# EAGLE design skatemate_proto (EAGLE 7.6.0)

## Sheet 1 of 3
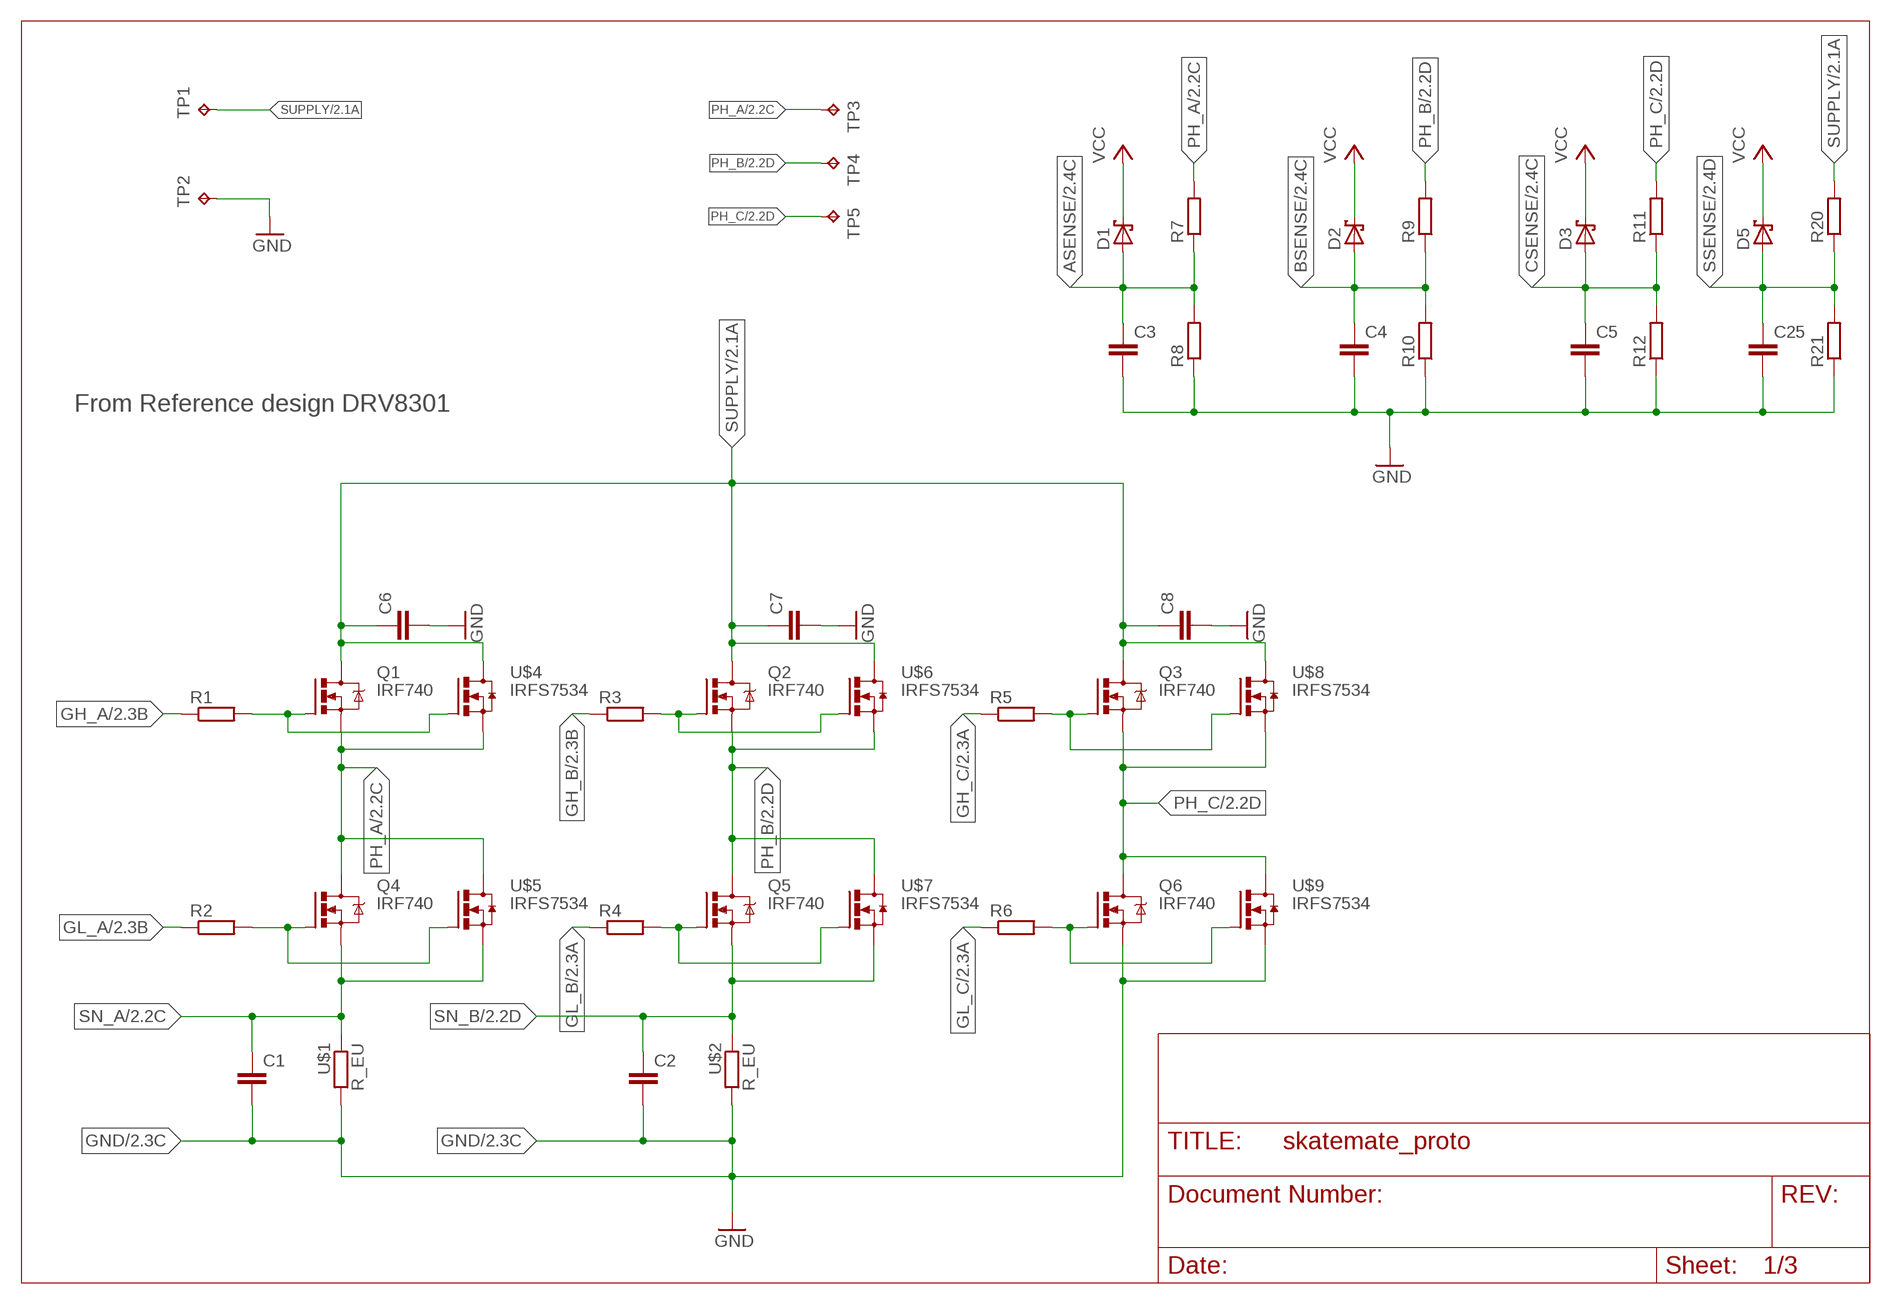
[diagram p0: schematic, sheet 1]

### Parts
C1  C-EUC0805  [C0805]
C2  C-EUC0805  [C0805]
C3  C-EUC0805  [C0805]
C4  C-EUC0805  [C0805]
C5  C-EUC0805  [C0805]
C6  C-EUC1206  [C1206]
C7  C-EUC1206  [C1206]
C8  C-EUC1206  [C1206]
C25  C-EUC0805  [C0805]
D1  SCHOTTKY-DIODESOD80C  [SOD80C]
D2  SCHOTTKY-DIODESOD80C  [SOD80C]
D3  SCHOTTKY-DIODESOD80C  [SOD80C]
D5  SCHOTTKY-DIODESOD80C  [SOD80C]
Q1  IRF740  [TO220BV]
Q2  IRF740  [TO220BV]
Q3  IRF740  [TO220BV]
Q4  IRF740  [TO220BV]
Q5  IRF740  [TO220BV]
Q6  IRF740  [TO220BV]
R1  R-EU_R0805  [R0805]
R2  R-EU_R0805  [R0805]
R3  R-EU_R0805  [R0805]
R4  R-EU_R0805  [R0805]
R5  R-EU_R0805  [R0805]
R6  R-EU_R0805  [R0805]
R7  R-EU_R0805  [R0805]
R8  R-EU_R0805  [R0805]
R9  R-EU_R0805  [R0805]
R10  R-EU_R0805  [R0805]
R11  R-EU_R0805  [R0805]
R12  R-EU_R0805  [R0805]
R20  R-EU_R0805  [R0805]
R21  R-EU_R0805  [R0805]
TP1  TPSMD_M_1006  [SMD_M_1006]
TP2  TPSMD_M_1006  [SMD_M_1006]
TP3  TPSMD_M_1006  [SMD_M_1006]
TP4  TPSMD_M_1006  [SMD_M_1006]
TP5  TPSMD_M_1006  [SMD_M_1006]
U$1  R_EU  [R2512]
U$2  R_EU  [R2512]
U$4  IRFS7534  [D2PAK-7]
U$5  IRFS7534  [D2PAK-7]
U$6  IRFS7534  [D2PAK-7]
U$7  IRFS7534  [D2PAK-7]
U$8  IRFS7534  [D2PAK-7]
U$9  IRFS7534  [D2PAK-7]

### Nets
ASENSE: C3.1 D1.A R7.1 R8.2 ; also sheet 2,3
BSENSE: C4.1 D2.A R9.1 R10.2 ; also sheet 2,3
CSENSE: C5.1 D3.A R11.1 R12.2 ; also sheet 2,3
GH_A: R1.1 ; also sheet 2
GH_B: R3.1 ; also sheet 2
GH_C: R5.1 ; also sheet 2
GL_A: R2.1 ; also sheet 2
GL_B: R4.1 ; also sheet 2
GL_C: R6.1 ; also sheet 2
GND: C1.2 C2.2 C3.2 C4.2 C5.2 C6.2 C7.2 C8.2 C25.2 Q6.S R8.1 R10.1 R12.1 R21.1 TP2.P$1(TP) U$1.2 U$2.2 U$9.S1(S) U$9.S2(S) U$9.S3(S) U$9.S4(S) U$9.S5(S) ; also sheet 2,3
N$7: Q1.G R1.2 U$4.G
N$8: Q4.G R2.2 U$5.G
N$9: Q5.G R4.2 U$7.G
N$10: Q2.G R3.2 U$6.G
N$11: Q3.G R5.2 U$8.G
N$12: Q6.G R6.2 U$9.G
PH_A: Q1.S Q4.D R7.2 TP3.P$1(TP) U$4.S1(S) U$4.S2(S) U$4.S3(S) U$4.S4(S) U$4.S5(S) U$5.D ; also sheet 2
PH_B: Q2.S Q5.D R9.2 TP4.P$1(TP) U$6.S1(S) U$6.S2(S) U$6.S3(S) U$6.S4(S) U$6.S5(S) U$7.D ; also sheet 2
PH_C: Q3.S Q6.D R11.2 TP5.P$1(TP) U$8.S1(S) U$8.S2(S) U$8.S3(S) U$8.S4(S) U$8.S5(S) U$9.D ; also sheet 2
SN_A: C1.1 Q4.S U$1.1 U$5.S1(S) U$5.S2(S) U$5.S3(S) U$5.S4(S) U$5.S5(S) ; also sheet 2
SN_B: C2.1 Q5.S U$2.1 U$7.S1(S) U$7.S2(S) U$7.S3(S) U$7.S4(S) U$7.S5(S) ; also sheet 2
SSENSE: C25.1 D5.A R20.1 R21.2 ; also sheet 2,3
SUPPLY: C6.1 C7.1 C8.1 Q1.D Q2.D Q3.D R20.2 TP1.P$1(TP) U$4.D U$6.D U$8.D ; also sheet 2
VCC: D1.C D2.C D3.C D5.C ; also sheet 2,3

### Notes on the sheet
- From Reference design DRV8301

## Sheet 2 of 3
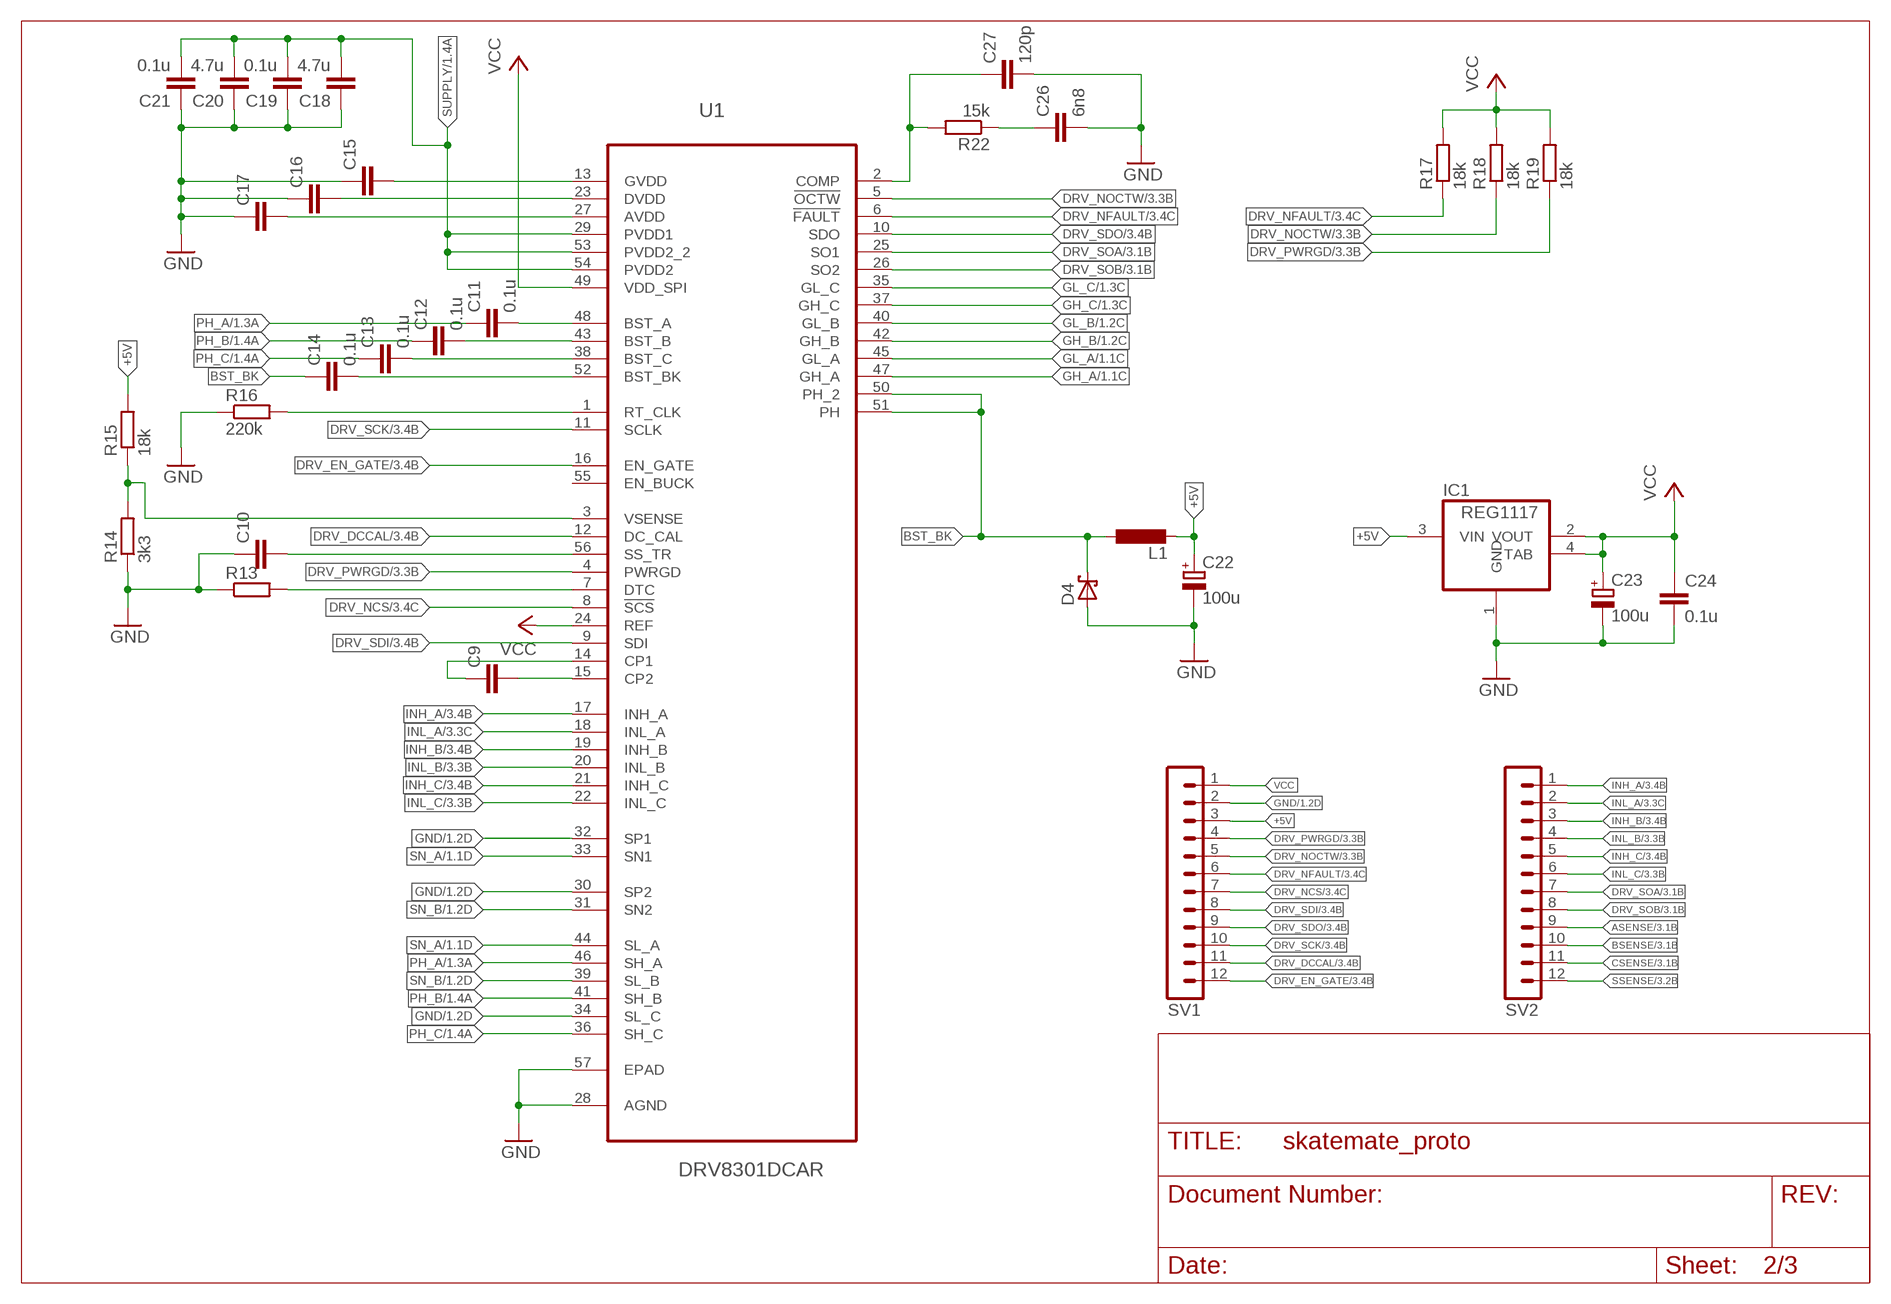
[diagram p1: schematic, sheet 2]

### Parts
C9  C-EUC0805  [C0805]
C10  C-EUC0805  [C0805]
C11  0.1u  C-EUC0805  [C0805]
C12  0.1u  C-EUC0805  [C0805]
C13  0.1u  C-EUC0805  [C0805]
C14  0.1u  C-EUC0805  [C0805]
C15  C-EUC0805  [C0805]
C16  C-EUC0805  [C0805]
C17  C-EUC0805  [C0805]
C18  4.7u  C-EUC0805  [C0805]
C19  0.1u  C-EUC0805  [C0805]
C20  4.7u  C-EUC0805  [C0805]
C21  0.1u  C-EUC0805  [C0805]
C22  100u  CPOL-EUB/3528-21W  [B/3528-21W]
C23  100u  CPOL-EUB/3528-21W  [B/3528-21W]
C24  0.1u  C-EUC0805  [C0805]
C26  6n8  C-EUC0805  [C0805]
C27  120p  C-EUC0805  [C0805]
D4  SCHOTTKY-DIODEDO-214AA  [DO-214AA]
IC1  REG1117  [SOT223]
L1  L-EUSDR0805  [SDR0805]
R13  R-EU_R0805  [R0805]
R14  3k3  R-EU_R0805  [R0805]
R15  18k  R-EU_R0805  [R0805]
R16  220k  R-EU_R0805  [R0805]
R17  18k  R-EU_R0805  [R0805]
R18  18k  R-EU_R0805  [R0805]
R19  18k  R-EU_R0805  [R0805]
R22  15k  R-EU_R0805  [R0805]
SV1  MA12-1  [MA12-1]
SV2  MA12-1  [MA12-1]
U1  DRV8301DCAR  [SOP50P810X120-57N]

### Nets
+5V: C22.+ IC1.3(VIN) L1.2 R15.2 SV1.3
ASENSE: SV2.9 ; also sheet 1,3
BSENSE: SV2.10 ; also sheet 1,3
BST_BK: C14.1 D4.C L1.1 U1.50(PH_2) U1.51(PH)
CSENSE: SV2.11 ; also sheet 1,3
DRV_DCCAL: SV1.11 U1.12(DC_CAL) ; also sheet 3
DRV_EN_GATE: SV1.12 U1.16(EN_GATE) ; also sheet 3
DRV_NCS: SV1.7 U1.8(!SCS) ; also sheet 3
DRV_NFAULT: R17.1 SV1.6 U1.6(!FAULT) ; also sheet 3
DRV_NOCTW: R18.1 SV1.5 U1.5(!OCTW) ; also sheet 3
DRV_PWRGD: R19.1 SV1.4 U1.4(PWRGD) ; also sheet 3
DRV_SCK: SV1.10 U1.11(SCLK) ; also sheet 3
DRV_SDI: SV1.8 U1.9(SDI) ; also sheet 3
DRV_SDO: SV1.9 U1.10(SDO) ; also sheet 3
DRV_SOA: SV2.7 U1.25(SO1) ; also sheet 3
DRV_SOB: SV2.8 U1.26(SO2) ; also sheet 3
GH_A: U1.47(GH_A) ; also sheet 1
GH_B: U1.42(GH_B) ; also sheet 1
GH_C: U1.37(GH_C) ; also sheet 1
GL_A: U1.45(GL_A) ; also sheet 1
GL_B: U1.40(GL_B) ; also sheet 1
GL_C: U1.35(GL_C) ; also sheet 1
GND: C10.1 C15.1 C16.1 C17.1 C18.1 C19.1 C20.1 C21.1 C22.- C23.- C24.2 C26.2 C27.2 D4.A IC1.1(GND) R13.1 R14.1 R16.1 SV1.2 U1.28(AGND) U1.30(SP2) U1.32(SP1) U1.34(SL_C) U1.57(EPAD) ; also sheet 1,3
INH_A: SV2.1 U1.17(INH_A) ; also sheet 3
INH_B: SV2.3 U1.19(INH_B) ; also sheet 3
INH_C: SV2.5 U1.21(INH_C) ; also sheet 3
INL_A: SV2.2 U1.18(INL_A) ; also sheet 3
INL_B: SV2.4 U1.20(INL_B) ; also sheet 3
INL_C: SV2.6 U1.22(INL_C) ; also sheet 3
N$1: C9.2 U1.15(CP2)
N$2: C9.1 U1.14(CP1)
N$3: R13.2 U1.7(DTC)
N$4: R14.2 R15.1 U1.3(VSENSE)
N$5: C10.2 U1.56(SS_TR)
N$6: R16.2 U1.1(RT_CLK)
N$13: C11.2 U1.48(BST_A)
N$14: C12.2 U1.43(BST_B)
N$15: C13.2 U1.38(BST_C)
N$16: C14.2 U1.52(BST_BK)
N$17: C15.2 U1.13(GVDD)
N$18: C16.2 U1.23(DVDD)
N$19: C17.2 U1.27(AVDD)
N$20: C27.1 R22.2 U1.2(COMP)
N$21: C26.1 R22.1
PH_A: C11.1 U1.46(SH_A) ; also sheet 1
PH_B: C12.1 U1.41(SH_B) ; also sheet 1
PH_C: C13.1 U1.36(SH_C) ; also sheet 1
SN_A: U1.33(SN1) U1.44(SL_A) ; also sheet 1
SN_B: U1.31(SN2) U1.39(SL_B) ; also sheet 1
SSENSE: SV2.12 ; also sheet 1,3
SUPPLY: C18.2 C19.2 C20.2 C21.2 U1.29(PVDD1) U1.53(PVDD2_2) U1.54(PVDD2) ; also sheet 1
VCC: C23.+ C24.1 IC1.2(VOUT) IC1.4(TAB) R17.2 R18.2 R19.2 SV1.1 U1.24(REF) U1.49(VDD_SPI) ; also sheet 1,3
Unconnected: U1.55(EN_BUCK)

## Sheet 3 of 3
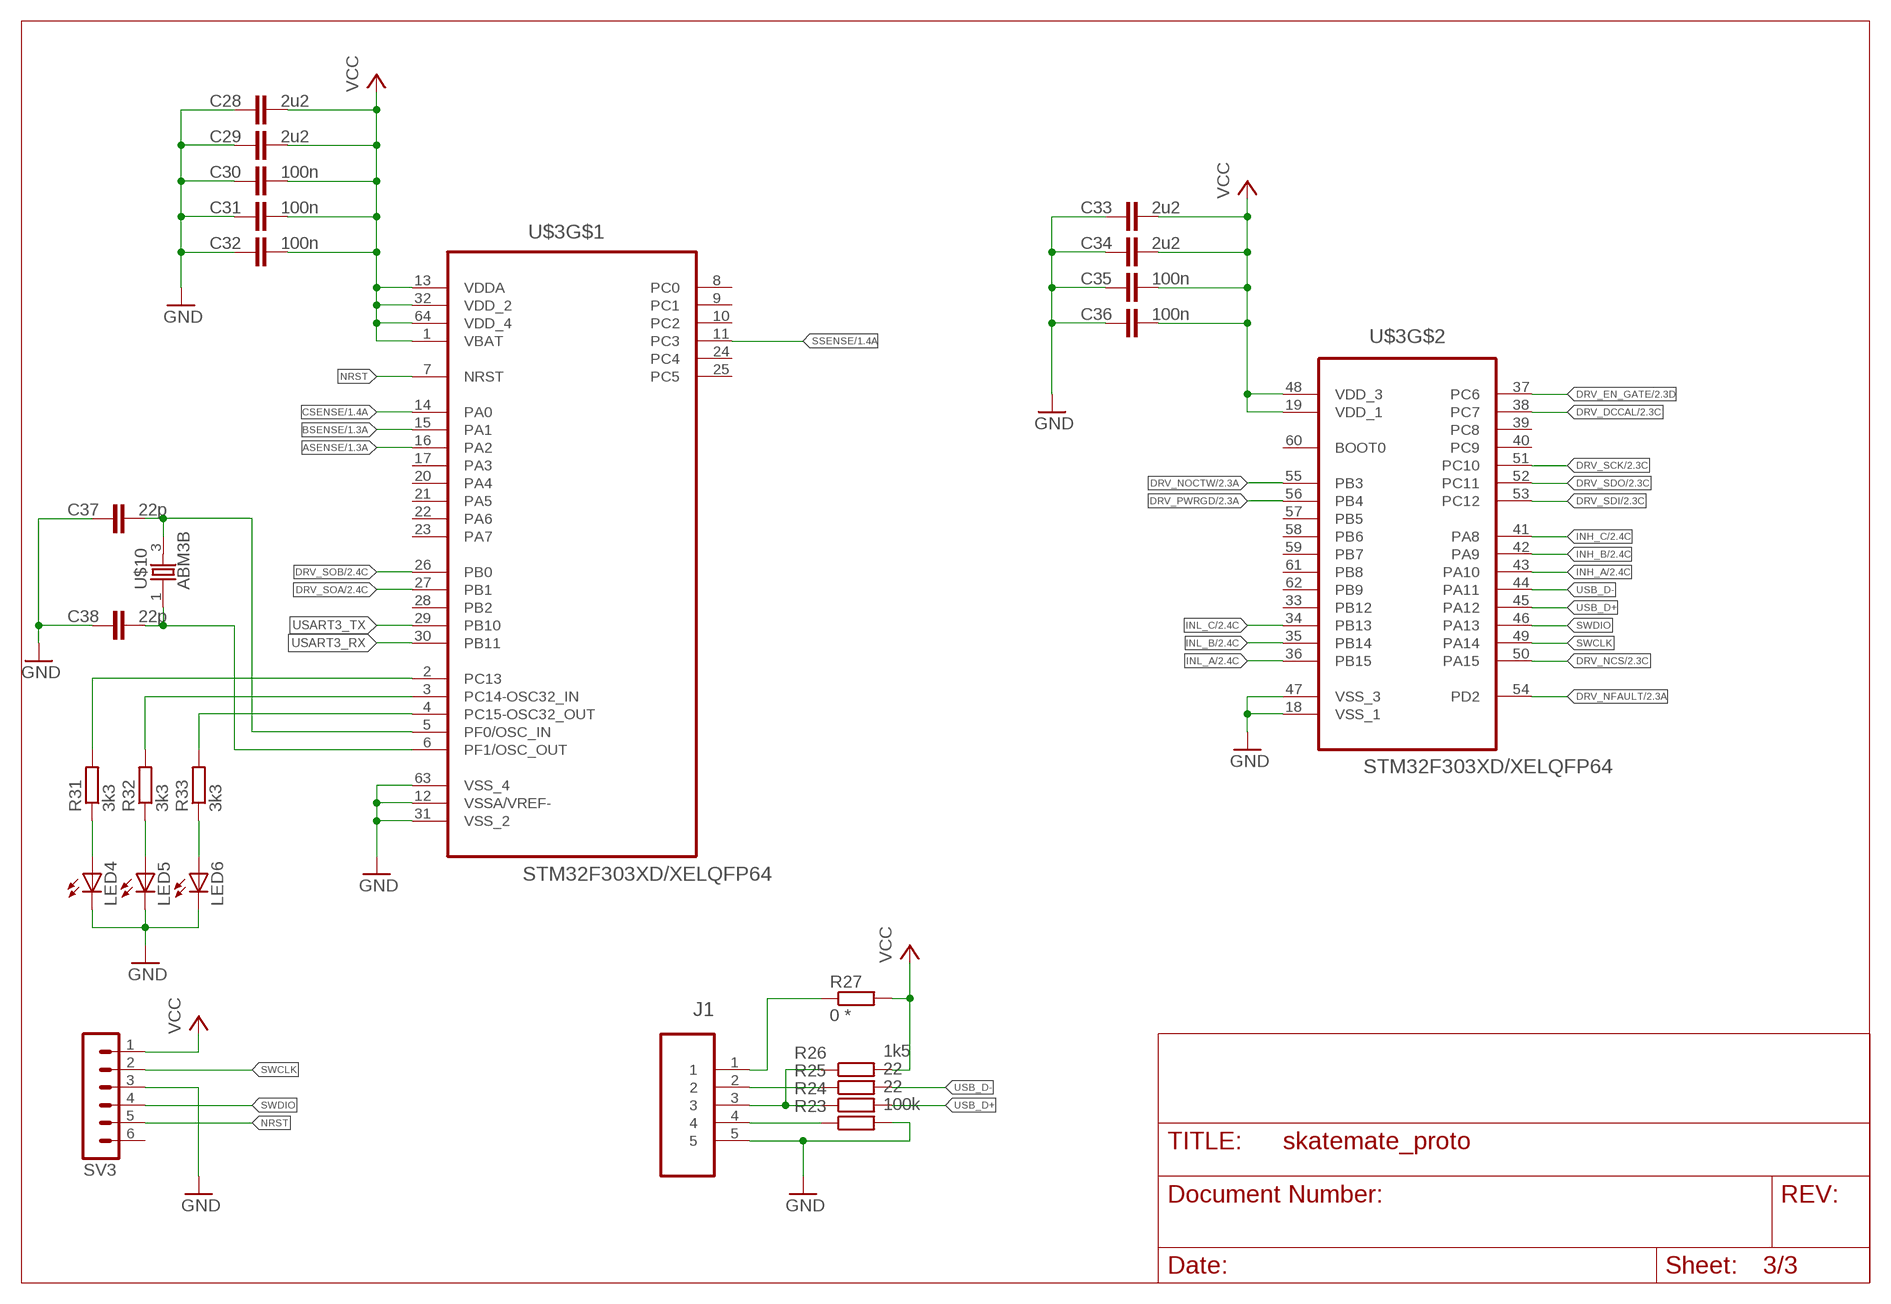
[diagram p2: schematic, sheet 3]

### Parts
C28  2u2  C-EUC0805  [C0805]
C29  2u2  C-EUC0805  [C0805]
C30  100n  C-EUC0805  [C0805]
C31  100n  C-EUC0805  [C0805]
C32  100n  C-EUC0805  [C0805]
C33  2u2  C-EUC0805  [C0805]
C34  2u2  C-EUC0805  [C0805]
C35  100n  C-EUC0805  [C0805]
C36  100n  C-EUC0805  [C0805]
C37  22p  C-EUC0805  [C0805]
C38  22p  C-EUC0805  [C0805]
J1  47346-0001  [MOLEX_47346-0001]
LED4  LEDCHIP-LED0805  [CHIP-LED0805]
LED5  LEDCHIP-LED0805  [CHIP-LED0805]
LED6  LEDCHIP-LED0805  [CHIP-LED0805]
R23  100k  R-EU_R0805  [R0805]
R24  22  R-EU_R0805  [R0805]
R25  22  R-EU_R0805  [R0805]
R26  1k5  R-EU_R0805  [R0805]
R27  0 *  R-EU_R0805  [R0805]
R31  3k3  R-EU_R0805  [R0805]
R32  3k3  R-EU_R0805  [R0805]
R33  3k3  R-EU_R0805  [R0805]
SV3  MA06-1  [MA06-1]
U$3  STM32F303XD/XELQFP64  [LQFP64]
U$10  ABM3B  [IQG5032B]

### Nets
ASENSE: U$3.16(PA2) ; also sheet 1,2
BSENSE: U$3.15(PA1) ; also sheet 1,2
CSENSE: U$3.14(PA0) ; also sheet 1,2
DRV_DCCAL: U$3.38(PC7) ; also sheet 2
DRV_EN_GATE: U$3.37(PC6) ; also sheet 2
DRV_NCS: U$3.50(PA15) ; also sheet 2
DRV_NFAULT: U$3.54(PD2) ; also sheet 2
DRV_NOCTW: U$3.55(PB3) ; also sheet 2
DRV_PWRGD: U$3.56(PB4) ; also sheet 2
DRV_SCK: U$3.51(PC10) ; also sheet 2
DRV_SDI: U$3.53(PC12) ; also sheet 2
DRV_SDO: U$3.52(PC11) ; also sheet 2
DRV_SOA: U$3.27(PB1) ; also sheet 2
DRV_SOB: U$3.26(PB0) ; also sheet 2
GND: C28.1 C29.1 C30.1 C31.1 C32.1 C33.1 C34.1 C35.1 C36.1 C37.1 C38.1 J1.5 LED4.C LED5.C LED6.C R23.2 SV3.3 U$3.12(VSSA/VREF-) U$3.18(VSS_1) U$3.31(VSS_2) U$3.47(VSS_3) U$3.63(VSS_4) ; also sheet 1,2
INH_A: U$3.43(PA10) ; also sheet 2
INH_B: U$3.42(PA9) ; also sheet 2
INH_C: U$3.41(PA8) ; also sheet 2
INL_A: U$3.36(PB15) ; also sheet 2
INL_B: U$3.35(PB14) ; also sheet 2
INL_C: U$3.34(PB13) ; also sheet 2
N$22: J1.4 R23.1
N$23: J1.3 R24.1 R26.1
N$24: J1.2 R25.1
N$25: J1.1 R27.1
N$28: R33.2 U$3.4(PC15-OSC32_OUT)
N$29: R32.2 U$3.3(PC14-OSC32_IN)
N$30: R31.2 U$3.2(PC13)
N$31: LED4.A R31.1
N$32: LED5.A R32.1
N$33: LED6.A R33.1
N$35: C38.2 U$3.6(PF1/OSC_OUT) U$10.1
N$36: C37.2 U$3.5(PF0/OSC_IN) U$10.3
NRST: SV3.5 U$3.7(NRST)
SSENSE: U$3.11(PC3) ; also sheet 1,2
SWCLK: SV3.2 U$3.49(PA14)
SWDIO: SV3.4 U$3.46(PA13)
USART3_RX: U$3.30(PB11)
USART3_TX: U$3.29(PB10)
USB_D+: R24.2 U$3.45(PA12)
USB_D-: R25.2 U$3.44(PA11)
VCC: C28.2 C29.2 C30.2 C31.2 C32.2 C33.2 C34.2 C35.2 C36.2 R26.2 R27.2 SV3.1 U$3.1(VBAT) U$3.13(VDDA) U$3.19(VDD_1) U$3.32(VDD_2) U$3.48(VDD_3) U$3.64(VDD_4) ; also sheet 1,2
Unconnected: SV3.6 U$3.8(PC0) U$3.9(PC1) U$3.10(PC2) U$3.17(PA3) U$3.20(PA4) U$3.21(PA5) U$3.22(PA6) U$3.23(PA7) U$3.24(PC4) U$3.25(PC5) U$3.28(PB2) U$3.33(PB12) U$3.39(PC8) U$3.40(PC9) U$3.57(PB5) U$3.58(PB6) U$3.59(PB7) U$3.60(BOOT0) U$3.61(PB8) U$3.62(PB9)

## Library data of the parts
C1-C21 C24-C38 = skatemate:C-EU: CAPACITOR, European symbol
C22 C23 = skatemate:CPOL-EU: POLARIZED CAPACITOR, European symbol
D1-D5 = skatemate:SCHOTTKY-DIODE: Schottky Diode
IC1 = skatemate:REG1117: 800mA and 1A Low Dropout (LDO) Positive Regulator 1.8V, 2.5V, 2.85V, 3.3V, 5V, and Adj; MPN: REG1117; OC_FARNELL: 1097566; OC_NEWARK: 14P6981
J1 = skatemate:47346-0001: CONN RCPT 5POS MICRO USB R/A SMD; MPN: 47346-0001; OC_FARNELL: 1568026; OC_NEWARK: 47M0505; PACKAGE: 5 POS MICRO USB R/A; SUPPLIER: MOLEX
L1 = skatemate:L-EU: INDUCTOR, European symbol
LED4-LED6 = skatemate:LED: LED OSRAM: - CHIPLED LG R971, LG N971, LY N971, LG Q971, LY Q971, LO R971, LY R971 LH N974, LH R974 LS Q976, LO Q976, LY Q976 LO Q996 - Hyper CHIPLED LW Q18S LB Q993, LB Q99A, LB R99A - SideLED LS A670, LO A670, LY A670, LG A670, LP A670 LB A673, LV A673, LT A673, LW A673 LH A674 LY A675 LS A676, LA A676, LO A676, LY A676, LW A676 LS A679, LY A679, LG A679 - Hyper Micro SIDELED® LS Y876, LA Y876, LO Y876, LY Y876 LT Y87S - SmartLED LW L88C, LW L88S LB L89C, LB L89S, LG L890 LS L89K, LO L89K, LY L89K LS L896, LA L896, LO L896, LY L896 - TOPLED LS T670, LO T670, LY T670, LG T670, LP T670 LSG T670, LSP T670, LSY T670, LOP T670, LYG T670 LG T671, LOG T671, LSG T671 LB T673, LV T673, LT T673, LW T673 LH T674 LS T676, LA T676, LO T676, LY T676, LB T676, LH T676, LSB T676, LW T676 LB T67C, LV T67C, LT T67C, LS T67K, LO T67K, LY T67K, LW E67C LS E67B, LA E67B, LO E67B, LY E67B, LB E67C, LV E67C, LT E67C LW T67C LS T679, LY T679, LG T679 LS T770, LO T770, LY T770, LG T770, LP T770 LB T773, LV T773, LT T773, LW T773 LH T774 LS E675, LA E675, LY E675, LS T675 LS T776, LA T776, LO T776, LY T776, LB T776 LHGB T686 LT T68C, LB T68C - Hyper Mini TOPLED® LB M676 - Mini TOPLED Santana® LG M470 LS M47K, LO M47K, LY M47K Source: http://www.osram.convergy.de LUXEON: - LUMILED® LXK2-PW12-R00, LXK2-PW12-S00, LXK2-PW14-U00, LXK2-PW14-V00 LXK2-PM12-R00, LXK2-PM12-S00, LXK2-PM14-U00 LXK2-PE12-Q00, LXK2-PE12-R00, LXK2-PE12-S00, LXK2-PE14-T00, LXK2-PE14-U00 LXK2-PB12-K00, LXK2-PB12-L00, LXK2-PB12-M00, LXK2-PB14-N00, LXK2-PB14-P00, LXK2-PB14-Q00 LXK2-PR12-L00, LXK2-PR12-M00, LXK2-PR14-Q00, LXK2-PR14-R00 LXK2-PD12-Q00, LXK2-PD12-R00, LXK2-PD12-S00 LXK2-PH12-R00, LXK2-PH12-S00 LXK2-PL12-P00, LXK2-PL12-Q00, LXK2-PL12-R00 Source: www.luxeon.com KINGBRIGHT: KA-3528ASYC Source: www.kingbright.com
Q1-Q6 = transistor-power:IRF740: N-CHANNEL MOS FET
R1-R27 R31-R33 = skatemate:R-EU_: RESISTOR, European symbol
SV1 SV2 = skatemate:MA12-1: PIN HEADER; OC_FARNELL: unknown; OC_NEWARK: unknown
SV3 = skatemate:MA06-1: PIN HEADER; OC_FARNELL: unknown; OC_NEWARK: unknown
TP1-TP5 = skatemate:TP: Test pad
U1 = skatemate:DRV8301DCAR: Three Phase Pre-Driver with Dual Current Shunt Amplifiers and Buck Regulator,HTSSOP-56; MPN: DRV8301DCAR; OC_FARNELL: 2045285; OC_NEWARK: 64T2938; PACKAGE: HTSSOP-56; SUPPLIER: TEXAS INSTRUMENTS
U$1 U$2 = skatemate:R_EU
U$3 = skatemate:STM32F303XD/XE
U$4-U$9 = skatemate:IRFS7534
U$10 = skatemate:ABM3B

## Board
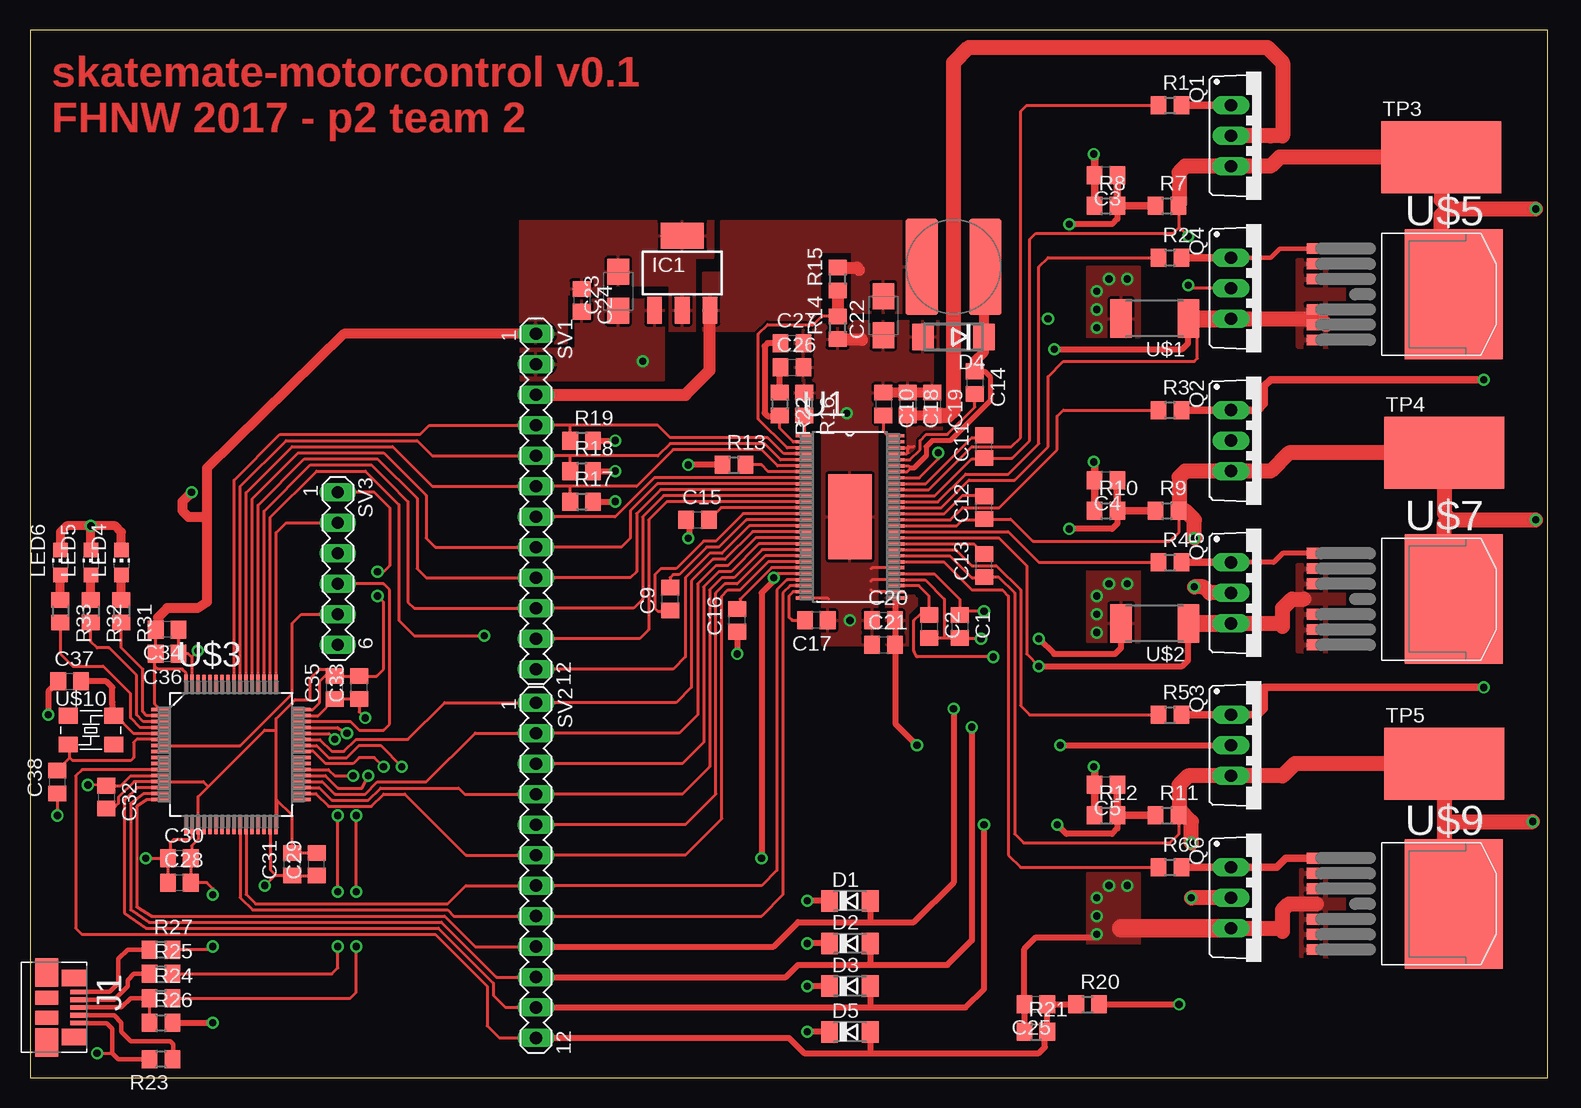
[diagram p3: board, top side]
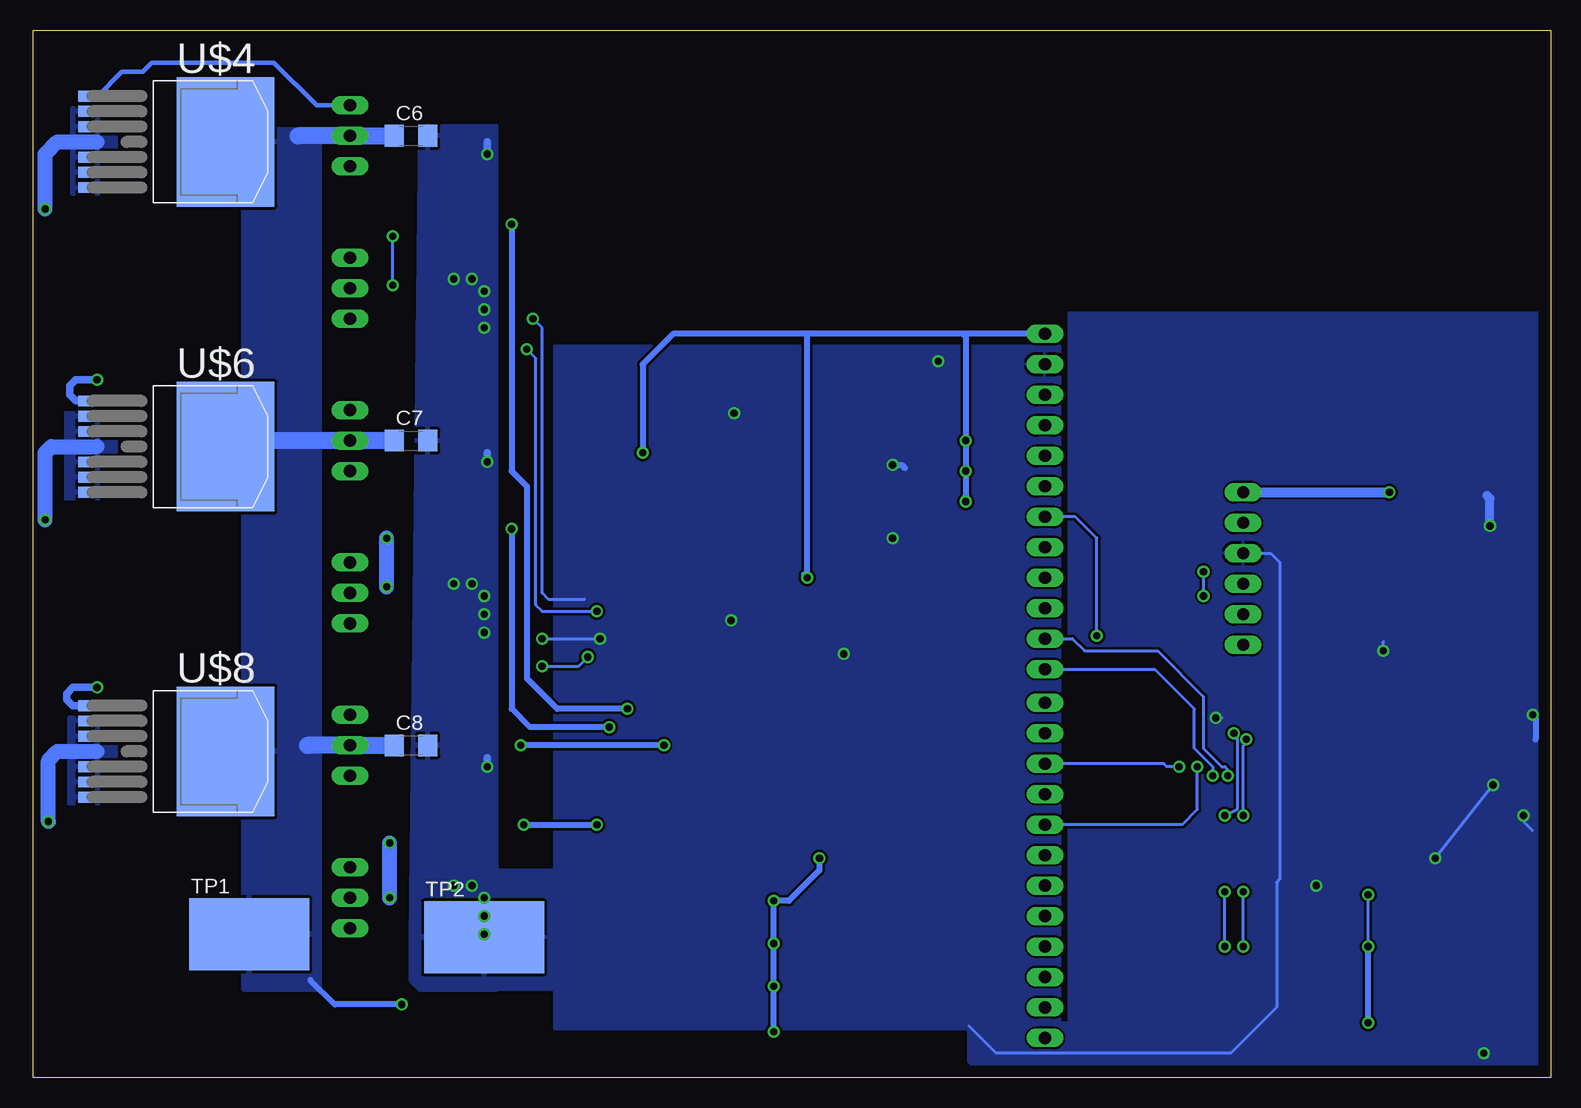
[diagram p4: board, bottom side, seen from below]

Size 126.47 x 87.3 mm. Coordinates in mm from the lower left corner, seen from the top.
Outline: 0,0 126.47,0 126.47,87.3 0,87.3 0,0
Copper layers (1*16): Top 0.035mm / dielectric 1.5mm / Bottom 0.035mm
Design rules "default": minimum track width 10mil, minimum drill 24mil, track to track 8mil, track to pad 8mil, pad to pad 8mil, via to via 8mil, smd to smd 8mil, copper to edge 40mil, drill to drill 8mil, minimum pad ring 10mil, minimum via ring 8mil, stop-mask expansion 4mil, vias tented up to drill 0mil, thermal gap 10mil

### Footprints (pad centres in the part's own frame; a part is rotated, then mirrored left to right if it is on the bottom)
C0805 = smd 1.3 x 1.5: 1 -0.95,0; 2 0.95,0
C1206 = smd 1.6 x 1.8: 1 -1.4,0; 2 1.4,0
B/3528-21W = smd 2.15 x 1.8: + 1.625,0; - -1.625,0
SOD80C = smd 1.4 x 1.8: A 1.7,0; C -1.7,0
DO-214AA = smd 1.8 x 2.2: A 2.55,0; C -2.55,0
SOT223 = smd 1.219 x 2.235: 1 -2.311,-3.099; 2 0,-3.099; 3 2.311,-3.099 | smd 3.6 x 2.2: 4 0,3.099
MOLEX_47346-0001 = smd 0.395 x 1.38: 1 -1.3,0; 2 -0.65,0; 3 0,0; 4 0.65,0; 5 1.3,0 | smd 1.4 x 2.1: M1 -2.462,-0.36; M2 2.462,-0.36 | smd 2.375 x 1.9: M3 -2.913,-2.66; M6 2.913,-2.66 | smd 1.175 x 1.9: M4 -0.82,-2.66; M5 0.85,-2.66
SDR0805 = smd 8 x 2.7: 1 0,2.65; 2 0,-2.65
CHIP-LED0805 = smd 1.2 x 1.2: A 0,-1.05; C 0,1.05
TO220BV = drill 1.016 long: D 0,-2.54; G -2.54,-2.54; S 2.54,-2.54
R0805 = smd 1.3 x 1.5: 1 -0.95,0; 2 0.95,0
MA12-1 = drill 1.016 long: 1 -13.97,0; 2 -11.43,0; 3 -8.89,0; 4 -6.35,0; 5 -3.81,0; 6 -1.27,0; 7 1.27,0; 8 3.81,0; 9 6.35,0; 10 8.89,0; 11 11.43,0; 12 13.97,0
MA06-1 = drill 1.016 long: 1 -6.35,0; 2 -3.81,0; 3 -1.27,0; 4 1.27,0; 5 3.81,0; 6 6.35,0
SMD_M_1006 = smd 10 x 6: P$1 0,0
SOP50P810X120-57N = smd 1.473 x 0.279: 1 -3.785,6.756; 2 -3.785,6.248; 3 -3.785,5.74; 4 -3.785,5.258; 5 -3.785,4.75; 6 -3.785,4.242; 7 -3.785,3.759; 8 -3.785,3.251; 9 -3.785,2.743; 10 -3.785,2.261; 11 -3.785,1.753; 12 -3.785,1.245; 13 -3.785,0.762; 14 -3.785,0.254; 15 -3.785,-0.254; 16 -3.785,-0.762; 17 -3.785,-1.245; 18 -3.785,-1.753; 19 -3.785,-2.261; 20 -3.785,-2.743; 21 -3.785,-3.251; 22 -3.785,-3.759; 23 -3.785,-4.242; 24 -3.785,-4.75; 25 -3.785,-5.258; 26 -3.785,-5.74; 27 -3.785,-6.248; 28 -3.785,-6.756; 29 3.785,-6.756; 30 3.785,-6.248; 31 3.785,-5.74; 32 3.785,-5.258; 33 3.785,-4.75; 34 3.785,-4.242; 35 3.785,-3.759; 36 3.785,-3.251; 37 3.785,-2.743; 38 3.785,-2.261; 39 3.785,-1.753; 40 3.785,-1.245; 41 3.785,-0.762; 42 3.785,-0.254; 43 3.785,0.254; 44 3.785,0.762; 45 3.785,1.245; 46 3.785,1.753; 47 3.785,2.261; 48 3.785,2.743; 49 3.785,3.251; 50 3.785,3.759; 51 3.785,4.242; 52 3.785,4.75; 53 3.785,5.258; 54 3.785,5.74; 55 3.785,6.248; 56 3.785,6.756 | smd 3.607 x 7.112: 57 0,0
R2512 = smd 1.8 x 3.2: 1 -2.8,0; 2 2.8,0
LQFP64 = smd 1.5 x 0.3: 1 -5.9,3.75; 2 -5.9,3.25; 3 -5.9,2.75; 4 -5.9,2.25; 5 -5.9,1.75; 6 -5.9,1.25; 7 -5.9,0.75; 8 -5.9,0.25; 9 -5.9,-0.25; 10 -5.9,-0.75; 11 -5.9,-1.25; 12 -5.9,-1.75; 13 -5.9,-2.25; 14 -5.9,-2.75; 15 -5.9,-3.25; 16 -5.9,-3.75; 33 5.9,-3.75; 34 5.9,-3.25; 35 5.9,-2.75; 36 5.9,-2.25; 37 5.9,-1.75; 38 5.9,-1.25; 39 5.9,-0.75; 40 5.9,-0.25; 41 5.9,0.25; 42 5.9,0.75; 43 5.9,1.25; 44 5.9,1.75; 45 5.9,2.25; 46 5.9,2.75; 47 5.9,3.25; 48 5.9,3.75 | smd 0.3 x 1.5: 17 -3.75,-5.9; 18 -3.25,-5.9; 19 -2.75,-5.9; 20 -2.25,-5.9; 21 -1.75,-5.9; 22 -1.25,-5.9; 23 -0.75,-5.9; 24 -0.25,-5.9; 25 0.25,-5.9; 26 0.75,-5.9; 27 1.25,-5.9; 28 1.75,-5.9; 29 2.25,-5.9; 30 2.75,-5.9; 31 3.25,-5.9; 32 3.75,-5.9; 49 3.75,5.9; 50 3.25,5.9; 51 2.75,5.9; 52 2.25,5.9; 53 1.75,5.9; 54 1.25,5.9; 55 0.75,5.9; 56 0.25,5.9; 57 -0.25,5.9; 58 -0.75,5.9; 59 -1.25,5.9; 60 -1.75,5.9; 61 -2.25,5.9; 62 -2.75,5.9; 63 -3.25,5.9; 64 -3.75,5.9
D2PAK-7 = smd 10.8 x 8.15: D 0,4.1 | smd 0.9 x 3.2: G -3.81,-6.56; S1 -2.54,-6.56; S2 -1.27,-6.56; S3 1.27,-6.56; S4 2.54,-6.56; S5 3.81,-6.56
IQG5032B = smd 1.6 x 1.3: 1 -1.9,-1.2; 2 1.9,-1.2; 3 1.9,1.2; 4 -1.9,1.2

### Placement (x,y rotation side)
C1  77.47,37.59 270 top
C2  74.93,37.59 270 top
C3  89.66,75.18 180 top
C4  89.66,49.78 180 top
C5  89.66,24.38 180 top
C6  95,78.49 0 bottom
C7  95,53.09 0 bottom
C8  95,27.69 0 bottom
C9  53.34,39.88 90 top
C10  71.12,56.13 270 top
C11  79.5,52.58 90 top
C12  79.5,47.5 90 top
C13  79.5,42.67 90 top
C14  78.74,57.91 270 top
C15  55.63,46.48 0 top
C16  58.93,38.1 90 top
C17  65.53,38.1 180 top
C18  73.15,56.13 270 top
C19  75.18,56.13 270 top
C20  71.12,38.1 0 top
C21  71.12,36.07 0 top
C22  71.12,63.5 90 top
C23  49.02,65.53 90 top
C24  45.97,64.77 270 top
C25  83.82,6.1 180 top
C26  63.5,59.18 0 top
C27  63.5,61.21 0 top
C28  12.45,16.26 0 top
C29  23.88,17.78 90 top
C30  12.45,18.29 0 top
C31  21.84,17.78 90 top
C32  6.35,23.37 270 top
C33  27.43,32.51 90 top
C34  11.43,37.34 180 top
C35  25.4,32.51 90 top
C36  11.43,35.31 180 top
C37  3.3,33.02 0 top
C38  2.29,24.64 90 top
D1  68.33,14.73 0 top
D2  68.33,11.18 0 top
D3  68.33,7.62 0 top
D4  76.96,61.72 180 top
D5  68.33,3.81 0 top
IC1  54.36,67.06 0 top
J1  4.06,5.84 270 top
L1  76.96,67.56 270 top
LED4  7.62,42.93 0 top
LED5  5.08,42.93 0 top
LED6  2.54,42.93 0 top
Q1  102.62,78.49 270 top
Q2  102.62,53.09 270 top
Q3  102.62,27.69 270 top
Q4  102.62,65.79 270 top
Q5  102.62,40.39 270 top
Q6  102.62,14.99 270 top
R1  95,81.03 0 top
R2  95,68.33 0 top
R3  95,55.63 0 top
R4  95,42.93 0 top
R5  95,30.23 0 top
R6  95,17.53 0 top
R7  94.74,72.64 0 top
R8  89.66,72.64 0 top
R9  94.74,47.24 0 top
R10  89.66,47.24 0 top
R11  94.74,21.84 0 top
R12  89.66,21.84 0 top
R13  58.67,51.05 0 top
R14  67.31,62.48 90 top
R15  67.31,66.55 90 top
R16  64.52,56.13 270 top
R17  45.97,48.01 0 top
R18  45.97,50.55 0 top
R19  45.97,53.09 0 top
R20  88.14,6.1 0 top
R21  83.82,3.81 0 top
R22  62.48,56.13 270 top
R23  10.92,1.52 180 top
R24  10.92,6.6 0 top
R25  10.92,8.64 0 top
R26  10.92,4.57 0 top
R27  10.92,10.67 0 top
R31  7.62,38.86 270 top
R32  5.08,38.86 270 top
R33  2.54,38.86 270 top
SV1  42.16,48.01 270 top
SV2  42.16,17.27 270 top
SV3  25.65,42.42 270 top
TP1  108.46,11.94 0 bottom
TP2  88.9,11.68 0 bottom
TP3  117.6,76.71 0 top
TP4  117.86,52.07 0 top
TP5  117.86,26.16 0 top
U1  68.33,46.74 0 top
U$1  93.73,63.25 180 top
U$2  93.73,37.85 180 top
U$3  16.76,26.92 0 top
U$4  114.55,77.98 270 bottom
U$5  114.55,65.28 270 top
U$6  114.55,52.58 270 bottom
U$7  114.55,39.88 270 top
U$8  114.55,27.18 270 bottom
U$9  114.55,14.48 270 top
U$10  5.08,28.96 0 top

### Tracks (layer width: path | path; a pad name or v marks a point on that pad's centre or on a via)
+5V
  Top 1.016: R15.2 68.9,67.5 69.09,67.31 | SV1.3 54.61,56.9 56.64,58.93 56.64,63.93 IC1.3
  pour Top: 75.44,71.37 75.44,63.75 68.58,63.75 68.58,71.37
  pour Top: 56.13,62.23 56.13,67.06 57.66,67.06 57.66,71.37 72.14,71.37 72.14,68.83 65.79,68.83 65.79,62.23
ASENSE  (via drill 0.6)
  Top 0.254: U$3.16 9.71,23.17 8.89,22.61 8.89,14.22 10.16,13.46 34.54,13.46 37.08,10.92 SV2.9
  Top 0.508: R8.2 90.61,71.56 90.17,71.12 v86.61,71.12 | v76.96,30.73 76.96,16.26 73.66,12.95 70.1,12.95 | SV2.9 61.98,10.92 64.01,12.95 70.1,12.95 | D1.A 70.03,13.03 70.1,12.95
  Top 0.61: R7.1 R8.2 C3.1
  Bottom 0.508: v86.61,71.12 86.61,50.55 85.34,49.28 85.34,33.27 82.8,30.73 v76.96,30.73
BSENSE  (via drill 0.6)
  Top 0.254: U$3.15 9.45,23.67 8.38,22.86 8.38,13.97 9.91,12.95 34.29,12.95 38.86,8.38 SV2.10
  Top 0.508: R10.2 90.61,46.16 90.17,45.72 v86.61,45.72 | v78.49,29.21 78.49,11.43 76.45,9.4 69.85,9.4 | SV2.10 62.99,8.38 64.01,9.4 69.85,9.4 | D2.A 70.03,9.57 69.85,9.4
  Top 0.61: R9.1 R10.2 C4.1
  Bottom 0.508: v86.61,45.72 86.61,30.73 85.09,29.21 v78.49,29.21
BST_BK
  Top 0.254: U1.51 73.23,50.98 73.41,50.8 73.1,50.49 U1.50
  Top 0.406: C14.1 79.57,58.86 80.01,58.42 80.01,56.39 76.71,53.09 75.18,53.09 74.68,52.58 74.68,51.82 73.66,50.8 73.41,50.8
  Top 0.813: C14.1 78.74,59.69 79.5,60.45 D4.C 79.51,67.46 L1.1
CSENSE  (via drill 0.6)
  Top 0.254: U$3.14 8.93,24.17 7.87,23.11 7.87,13.72 9.65,12.45 34.04,12.45 38.61,7.87 38.61,6.86 39.62,5.84 SV2.11
  Top 0.508: R12.2 90.61,20.76 90.17,20.32 86.36,20.32 v85.6,21.08 | SV2.11 70.1,5.84 | 70.1,5.84 77.98,5.84 79.5,7.37 v79.5,21.08 | D3.A 70.03,5.92 70.1,5.84
  Top 0.61: R11.1 R12.2 C5.1
  Bottom 0.508: v85.6,21.08 v79.5,21.08
DRV_DCCAL  (via drill 0.6)
  Top 0.254: U1.12 53.06,47.98 51.56,46.48 51.56,37.34 50.8,36.58 SV1.11 | U$3.38 24.87,25.67 25.4,25.15 v26.92,25.15
  Bottom 0.254: SV1.11 39.88,36.58 38.86,35.56 32.77,35.56 28.96,31.75 28.96,27.43 27.43,25.91 27.18,25.91 26.92,25.65 v26.92,25.15
DRV_EN_GATE  (via drill 0.6)
  Top 0.254: SV1.12 53.59,34.04 54.61,35.05 54.61,41.66 56.64,43.69 57.66,43.69 59.94,45.97 U1.16 | U$3.37 24.61,25.17 25.65,24.13 27.69,24.13 v28.19,25.15
  Bottom 0.254: SV1.12 33.02,34.04 29.72,30.73 29.72,27.43 28.19,25.91 v28.19,25.15
DRV_NCS  (via drill 0.6)
  Top 0.254: U1.8 52.02,49.99 48.77,46.74 SV1.7 | v37.85,36.83 32,36.83 30.73,38.1 30.73,47.75 27.94,50.55 23.88,50.55 20.01,46.68 U$3.50
  Bottom 0.254: v37.85,36.83 37.85,44.96 39.62,46.74 SV1.7
DRV_NFAULT
  Top 0.254: U1.6 62.31,50.98 60.96,52.32 53.59,52.32 50.55,49.28 44.96,49.28 | 44.96,49.28 SV1.6 33.53,49.28 30.23,52.58 21.84,52.58 18.01,48.75 U$3.54 | R17.1 45.02,49.21 44.96,49.28
DRV_NOCTW
  Top 0.254: U1.5 62.56,51.49 61.21,52.83 53.34,52.83 52.32,51.82 44.96,51.82 | 44.96,51.82 SV1.5 33.53,51.82 32.26,53.09 21.34,53.09 17.51,49.26 U$3.55 | R18.1 45.02,51.75 44.96,51.82
DRV_PWRGD
  Top 0.254: U1.4 62.81,51.99 61.47,53.34 53.34,53.34 52.32,54.36 44.96,54.36 | 44.96,54.36 SV1.4 33.27,54.36 32.51,53.59 20.83,53.59 17.01,49.78 U$3.56 | R19.1 45.02,54.29 44.96,54.36
DRV_SCK
  Top 0.254: U1.11 52.81,48.49 51.05,46.74 51.05,39.88 50.29,39.12 SV1.10 32,39.12 31.5,39.62 31.5,48.01 29.84,49.66 29.72,49.78 28.45,51.05 23.37,51.05 19.51,47.2 U$3.51
DRV_SDI
  Top 0.254: U1.9 52.27,49.48 50.04,47.24 50.04,44.96 49.28,44.2 SV1.8 33.78,44.2 33.02,44.96 33.02,48.51 29.46,52.07 22.35,52.07 18.51,48.23 U$3.53
DRV_SDO
  Top 0.254: U1.10 52.55,49 50.55,46.99 50.55,42.16 50.04,41.66 SV1.9 33.02,41.66 32.26,42.42 32.26,48.26 28.96,51.56 22.86,51.56 19.01,47.72 U$3.52
DRV_SOA
  Top 0.254: U1.25 63.07,41.48 62.23,40.64 62.23,17.27 60.96,16 SV2.7 36.32,16 34.8,14.48 18.8,14.48 18.01,15.26 U$3.27
DRV_SOB
  Top 0.254: U1.26 63.35,41 62.74,40.39 62.74,15.24 60.96,13.46 SV2.8 35.31,13.46 34.8,13.97 18.54,13.97 17.51,15 U$3.26
GH_A
  Top 0.254: U1.47 74.91,49 78.49,52.58 81.79,52.58 82.55,53.34 82.55,80.52 83.06,81.03 R1.1
GH_B
  Top 0.254: U1.42 76.71,46.48 77.72,47.5 80.77,47.5 85.6,52.32 85.6,55.12 86.11,55.63 R3.1 94.49,55.63
GH_C
  Top 0.254: U1.37 77.17,43.99 78.49,42.67 80.52,42.67 82.55,40.64 82.55,30.99 83.31,30.23 R5.1
GL_A
  Top 0.254: U1.45 75.67,47.98 77.98,50.29 81.53,50.29 84.07,52.83 84.07,67.56 84.84,68.33 R2.1
GL_B
  Top 0.254: U1.40 81.51,45.49 84.07,42.93 R4.1
GL_C
  Top 0.254: U1.35 76.15,42.98 78.49,40.64 81.03,40.64 81.53,40.13 81.53,18.54 82.55,17.53 R6.1
GND  (via drill 0.6)
  Top 0.254: 76.2,36.64 C2.2 76.01,36.64 | 76.2,36.64 C1.2 77.54,36.58 v79.25,36.58 | 76.2,36.64 76.2,39.88 74.6,41.48 U1.32 70.18,41.48 70.1,41.4 | C35.1 C33.1 | C29.1 C31.1 20.51,16.83 | U$3.18 13.51,20.12 13.21,19.81 11.94,19.81 11.68,19.56 11.68,18.48 C30.1 | C30.1 C28.1 | C34.1 C36.1 13.21,35.31 13.51,35 U$3.63 13.51,35.1 v13.97,35.56 | U1.30 70.26,40.49 70.1,40.64 | U1.34 70.18,42.49 70.1,42.42 | U1.28 66.45,39.98 66.55,39.88 | v4.83,24.38 C32.1 7.55,24.32 8.38,25.15 10.84,25.15 U$3.12 | v9.65,18.29 C30.1 | 20.51,16.83 20.07,17.27 20.07,20.97 U$3.31 | C35.1 27.37,31.56 27.43,31.5 27.43,30.48 v27.94,29.97 | U$3.47 24.01,30.17 C35.1 | 20.51,16.83 20.39,16.83 v19.56,16 | v5.59,2.03 6.86,2.03 | C38.1 v2.29,21.84
  Top 0.381: J1.5 6.38,4.54 6.86,4.06 6.86,2.03 7.37,1.52 R23.2
  Top 0.508: C16.1 v58.93,35.31 | C15.1 54.93,46.04 54.93,45.02 v54.86,44.96 | R21.1 C25.2 82.87,10.73 83.82,11.68 TP2.P$1 | v84.07,36.58 85.34,35.31 90.42,35.31 90.93,35.81 U$2.2 | R13.1 v54.86,51.05 | C37.1 1.52,32.19 v1.52,30.23
  Top 0.61: R8.1 C3.2 88.71,76.9 v88.65,76.96 | R10.1 C4.2 88.71,51.24 v88.65,51.31 | R12.1 C5.2 88.71,25.84 v88.65,25.91
  Top 0.762: v5.08,45.97 3.05,45.97 2.54,45.47 LED6.C | LED5.C v5.08,45.97 | LED4.C 7.62,45.47 7.11,45.97 v5.08,45.97
  Top 0.813: C19.1 C18.1 C10.1
  Top 1.016: R14.1 69.28,61.53 69.34,61.47
  Top 1.27: Q6.S 104.14,12.45 104.39,12.19 104.39,13.97 104.9,14.48 107.19,14.48
  Top 1.524: Q6.S 90.93,12.45
  Bottom 0.254: v84.07,36.58 v79.25,36.58 | v84.84,63.25 84.07,62.48 84.07,40.39 83.57,39.88 80.52,39.88 | v4.83,24.38 v9.65,18.29 | v27.94,29.97 27.43,29.97 | v13.97,35.56 13.97,36.32 | SV3.3 23.37,43.69 22.61,42.93 22.61,16.51 22.86,16.26 22.86,5.84 26.67,2.03 46.23,2.03 48.51,4.32 | v2.29,21.84 2.29,21.34 1.52,20.57
  Bottom 0.508: v54.86,51.05 54.1,51.05 53.85,50.8 | v1.52,30.23 1.27,29.97 1.27,28.19
  Bottom 0.61: v88.65,76.96 88.65,77.98 | v88.65,51.31 88.65,52.07 | v88.65,25.91 88.65,26.67
  Bottom 0.762: v5.08,45.97 5.08,48.26 5.33,48.51
  other vias: 88.9,37.08 88.9,38.61 88.9,40.13 89.92,41.15 91.44,41.15 88.9,62.48 88.9,64.01 88.9,65.53 89.92,66.55 91.44,66.55 88.9,11.94 88.9,13.46 88.9,14.99 89.92,16 91.44,16 68.33,38.1 68.07,55.37 51.05,59.69
  pour Bottom: 87.88,79.25 94.23,79.25 95,11.43 95,8.13 94.23,7.37 87.88,7.37
  pour Top: 66.04,56.64 66.04,36.07 70.61,36.07 70.61,56.64
  pour Top: 75.69,60.71 75.69,62.99 68.58,62.99 68.58,60.71
  pour Top: 63.75,56.64 63.75,62.74 75.18,62.74 75.18,56.64
  pour Top: 40.89,58.17 52.83,58.17 52.83,64.77 45.47,64.77 45.47,60.71 40.89,60.71
  pour Top: 92.46,36.32 88.14,36.32 88.14,42.16 92.46,42.16
  pour Top: 92.46,61.72 88.14,61.72 88.14,67.56 92.46,67.56
  pour Top: 92.46,11.18 88.14,11.18 88.14,17.02 92.46,17.02
  pour Bottom: 40.89,60.96 83.06,60.96 83.06,17.27 90.93,17.27 90.93,7.37 83.06,7.37 83.06,4.06 40.89,4.06
  pour Bottom: 40.13,63.75 0.76,63.75 0.76,1.02 40.13,1.02 40.13,1.27
  pour Bottom (no thermals): 39.62,1.27 39.88,1.02 48.26,1.02 48.51,1.27 48.51,4.57 44.2,4.57 39.37,4.57 39.37,1.27
  pour Top: 109.47,17.27 105.92,17.27 105.92,10.16 109.47,10.16
INH_A
  Top 0.254: U1.17 60.22,45.49 57.91,43.18 56.9,43.18 55.12,41.4 55.12,32.51 53.85,31.24 SV2.1 34.54,31.24 31.5,28.19 27.18,28.19 26.16,27.18 25.15,27.18 24.15,28.17 U$3.43
INH_B  (via drill 0.6)
  Top 0.254: SV2.3 54.36,26.16 56.13,27.94 56.13,40.89 57.4,42.16 58.42,42.16 60.73,44.48 U1.19 | v30.99,25.91 29.21,27.69 27.43,27.69 26.42,26.67 24.89,26.67 23.89,27.67 U$3.42
  Bottom 0.254: v30.99,25.91 32,25.91 32.26,26.16 SV2.3 42.67,26.16
INH_C  (via drill 0.6)
  Top 0.254: SV2.5 54.61,21.08 57.15,23.62 57.15,40.39 57.91,41.15 58.93,41.15 61.27,43.48 U1.21 | v29.46,25.91 28.7,26.67 27.43,26.67 26.92,26.16 24.64,26.16 23.62,27.18 U$3.41
  Bottom 0.254: SV2.5 30.73,21.08 29.46,22.35 v29.46,25.91
INL_A
  Top 0.254: U1.18 60.48,44.98 58.17,42.67 57.15,42.67 55.63,41.15 55.63,30.23 54.1,28.7 SV2.2 37.08,28.7 33.02,24.64 28.96,24.64 27.94,23.62 25.4,23.62 24.35,24.67 U$3.36
INL_B
  Top 0.254: U1.20 61.01,43.99 58.67,41.66 57.66,41.66 56.64,40.64 56.64,25.91 54.36,23.62 SV2.4 36.22,23.62 35.71,24.13 29.21,24.13 28.19,23.11 25.15,23.11 24.09,24.17 U$3.35
INL_C
  Top 0.254: U1.22 61.52,42.98 59.18,40.64 58.17,40.64 57.66,40.13 57.66,21.59 54.61,18.54 SV2.6 36.32,18.54 31.24,23.62 29.46,23.62 28.45,22.61 24.89,22.61 23.82,23.67 U$3.34
N$1
  Top 0.254: U1.15 59.69,46.48 57.4,44.2 56.39,44.2 54.1,41.91 53.59,41.91 53.34,41.66 C9.2 53.34,40.39
N$2
  Top 0.254: C9.1 53.27,38.86 52.32,38.86 52.07,39.12 52.07,41.91 52.58,42.42 53.85,42.42 56.13,44.7 57.15,44.7 59.44,46.99 U1.14
N$3
  Top 0.254: U1.7 61.52,50.49 60.96,51.05 R13.2
N$4
  Top 0.254: U1.3 63.09,52.48 60.71,54.86 60.71,61.98 61.47,62.74 65.28,62.74 66.04,63.5 67.24,63.5 R14.2
  Top 1.016: R15.1 R14.2
N$5
  Top 0.254: C10.2 71.12,53.85 71.48,53.49 U1.56
N$6
  Top 0.254: R16.2 64.52,53.52 U1.1
N$7
  Top 0.61: R1.2 Q1.G
  Bottom 0.381: U$4.G 119.08,83.82 117.35,83.82 116.59,84.58 106.43,84.58 102.87,81.03 Q1.G
N$8
  Top 0.381: U$5.G 104.14,69.09 103.38,68.33 99.57,68.33
  Top 0.61: R2.2 99.57,68.33 Q4.G
N$9
  Top 0.406: U$7.G 104.39,43.69 103.63,42.93 Q5.G
  Top 0.61: R4.2 Q5.G
N$10  (via drill 0.6)
  Top 0.61: R3.2 Q2.G 102.36,55.63 102.87,56.13 102.87,57.66 103.38,58.17 v121.16,58.17
  Bottom 0.61: v121.16,58.17 122.94,58.17 123.44,57.66 123.44,56.9 122.94,56.39 U$6.G
N$11  (via drill 0.6)
  Top 0.61: R5.2 Q3.G 102.36,30.23 102.87,30.73 102.87,32.51 v121.16,32.51
  Bottom 0.61: v121.16,32.51 123.19,32.51 123.7,32 123.7,31.5 123.19,30.99 U$8.G
N$12
  Top 0.61: R6.2 Q6.G 103.89,17.53 104.65,18.29 U$9.G
N$13
  Top 0.254: U1.48 74.62,49.48 78.49,53.34 79.31,53.34 C11.2
N$14
  Top 0.254: U1.43 76.2,46.99 77.72,48.51 79.44,48.51 C12.2
N$15
  Top 0.254: U1.38 78.65,44.48 C13.2
N$16
  Top 0.254: 78.74,56.39 C14.2 78.74,55.88 76.45,53.59 74.68,53.59 74.17,53.09 74.17,52.32 73.33,51.49 U1.52
N$17
  Top 0.254: U1.13 57.59,47.5 C15.2
N$18
  Top 0.254: U1.23 61.8,42.49 59.18,39.88 59.18,39.3 C16.2
N$19
  Top 0.254: U1.27 63.6,40.49 63.25,40.13 63.25,38.35 63.5,38.1 C17.2
N$20
  Top 0.254: U1.2 63.6,52.98 62.48,54.1 R22.2
  Top 0.508: C27.1 61.47,61.21 61.21,60.96 61.21,55.37 61.47,55.12 62.42,55.12 R22.2
N$21
  Top 0.508: R22.1 62.48,59.12 C26.1
N$22
  Top 0.381: J1.4 7,5.19 7.62,4.57 7.62,3.81 8.38,3.05 11.68,3.05 11.94,2.79 11.94,1.59 R23.1
N$23
  Top 0.254: R26.1 R24.1
  Top 0.381: J1.3 7.62,5.84 8.38,6.6 R24.1
N$24
  Top 0.381: J1.2 7,6.49 8.13,7.62 8.13,8.13 8.64,8.64 R25.1
N$25
  Top 0.381: J1.1 6.63,7.14 7.37,7.87 7.37,9.91 8.13,10.67 R27.1
N$26  (via drill 0.6)
  other vias: 28.96,40.13
N$27  (via drill 0.6)
  other vias: 28.96,42.16
N$28
  Top 0.254: R33.2 2.54,35.31 3.56,34.29 6.1,34.29 8.38,32 8.38,29.97 9.18,29.17 U$3.4
N$29
  Top 0.254: U$3.3 9.44,29.67 8.89,30.23 8.89,33.53 6.6,35.81 5.59,35.81 5.08,36.32 R32.2
N$30
  Top 0.254: U$3.2 9.7,30.17 9.4,30.48 9.4,34.04 7.62,35.81 R31.2
N$31
  Top 0.762: R31.1 LED4.A
N$32
  Top 0.762: R32.1 LED5.A
N$33
  Top 0.762: R33.1 LED6.A
N$35
  Top 0.254: U$3.6 10.84,28.19 8.89,28.19 8.64,27.94 8.64,26.67 8.38,26.42 3.56,26.42 3.3,26.67 | 3.3,26.67 3.3,27.63 U$10.1 | C38.2 2.29,25.65 3.3,26.67
N$36
  Top 0.254: U$10.3 6.98,30.36 | U$3.5 8.66,28.67 6.98,30.36 | 6.98,30.61 6.98,30.36
  Top 0.508: U$10.3 6.86,31.29 6.86,32.51 6.35,33.02 C37.2
NRST
  Top 0.254: U$3.7 17.51,27.67 21.84,32 21.84,37.85 22.61,38.61 SV3.5
PH_A  (via drill 0.6)
  Top 0.254: U1.46 75.41,48.49 78.49,51.56 79.44,51.56 C11.1 81.85,51.63 83.31,53.09 83.31,69.85 83.82,70.36 95.25,70.36 95.76,70.87 | 95.76,70.87 95.76,72.58 R7.2 | Q4.D 96.77,65.79 v96.52,66.04 | v96.52,70.1 95.76,70.87
  Top 1.27: 118.24,72.52 117.6,73.15 TP3.P$1 104.14,76.71 103.38,75.95 Q1.S 96.27,75.95 95.76,75.44 95.76,72.71 R7.2 | 118.24,72.52 118.36,72.39 v125.48,72.39 | U$5.D 118.65,68.04 117.6,69.09 117.6,71.88 118.24,72.52
  Bottom 0.254: v96.52,66.04 v96.52,70.1
  Bottom 1.27: v125.48,72.39 125.48,76.96 124.46,77.98 121.16,77.98
  pour Bottom: 123.19,80.77 119.63,80.77 119.63,73.66 123.19,73.66
PH_B  (via drill 0.6)
  Top 0.254: U1.41 77.22,45.97 77.72,46.48 79.44,46.48 C12.1 81.72,46.55 83.57,44.7 95,44.7 95.76,45.47 95.76,47.18 R9.2
  Top 1.27: 118.24,46.61 117.86,46.99 TP4.P$1 104.9,52.07 103.38,50.55 Q2.S 96.27,50.55 95.76,50.04 95.76,47.31 R9.2 96.27,47.24 97.03,46.48 v97.03,44.96 | 118.24,46.61 118.36,46.48 v125.48,46.48 | U$7.D 118.65,41.37 117.86,42.16 117.86,46.23 118.24,46.61 | Q5.D 98.3,40.39 97.79,40.89 v97.03,40.89
  Bottom 1.27: v125.48,46.48 125.48,52.07 124.97,52.58 121.16,52.58 | v97.03,40.89 v97.03,44.96
  pour Bottom: 123.7,55.37 119.63,55.37 119.63,48.26 123.7,48.26
PH_C  (via drill 0.6)
  Top 0.254: U1.36 76.66,43.48 78.49,41.66 79.44,41.66 C13.1 80.71,41.72 82.04,40.39 82.04,20.32 82.8,19.56 95,19.56 95.76,20.32 95.76,21.78 R11.2 | 117.86,14.48 U$9.D
  Top 1.27: 95.76,22.35 95.76,24.38 96.52,25.15 Q3.S 104.39,25.15 105.41,26.16 TP5.P$1 117.86,21.34 | 95.76,22.35 95.76,21.91 R11.2 | Q6.D v96.77,14.99 | v96.77,19.56 96.77,21.34 95.76,22.35 | 117.86,21.34 117.86,14.48 | 117.86,21.34 v125.22,21.34
  Bottom 1.27: v96.77,14.99 v96.77,19.56 | v125.22,21.34 125.22,26.42 124.46,27.18 121.16,27.18
  pour Bottom: 123.44,29.97 119.63,29.97 119.63,22.86 123.44,22.86
SN_A  (via drill 0.6)
  Top 0.254: v79.5,38.86 78.04,38.86 C1.1 77.47,39.88 75.36,41.99 U1.33 | U1.44 75.95,47.5 78.23,49.78 82.04,49.78 84.84,52.58 84.84,58.42 86.11,59.69 97.03,59.69 97.28,59.94 97.28,62.49 U$1.1
  Top 0.508: v85.34,60.71 96.01,60.71 96.52,61.21 U$1.1
  Top 1.27: Q4.S 107.49,63.25 U$5.S4
  Top 1.422: U$1.1 Q4.S
  Bottom 0.254: v79.5,38.86 84.07,38.86 84.58,39.37 84.58,59.94 v85.34,60.71
  pour Top: 109.47,68.07 105.66,68.07 105.66,60.96 109.47,60.96
SN_B  (via drill 0.6)
  Top 0.254: v80.26,35.05 73.91,35.05 73.66,35.56 73.66,38.1 74.17,38.61 74.86,38.61 C2.1 74.93,40.13 74.07,41 U1.31 | U1.39 80.75,44.98 83.06,42.67 83.06,35.31 v84.07,34.29
  Top 0.508: v84.07,34.29 96.01,34.29 96.52,34.8 U$2.1
  Top 1.27: Q5.S 104.14,37.85 104.39,37.59 104.39,39.12 105.16,39.88 106.17,39.88
  Top 1.422: U$2.1 Q5.S
  Bottom 0.254: v84.07,34.29 81.03,34.29 v80.26,35.05
  pour Top: 109.47,42.67 105.66,42.67 105.66,35.56 109.47,35.56
SSENSE
  Top 0.254: U$3.11 4.34,25.67 3.81,25.15 3.81,12.45 4.32,11.94 33.78,11.94 38.1,7.62 38.1,4.32 39.12,3.3 SV2.12
  Top 0.508: SV2.12 63.25,3.3 64.52,2.03 70.1,2.03 | 70.1,2.03 84.07,2.03 84.58,2.54 84.58,3.62 R21.2 C25.1 R20.1 | D5.A 70.03,2.11 70.1,2.03
SUPPLY  (via drill 0.6)
  Top 0.254: U1.54 73.05,52.48 | 73.05,52.48 73.15,52.58 73.66,52.58 | U1.53 73.08,51.99 73.15,52.07 73.15,52.38 73.05,52.48
  Top 0.508: R20.2 v95.76,6.1 | U1.29 72.11,29.49 v73.91,27.69 | v85.85,27.69 Q3.D
  Top 0.813: C18.2 75.12,55.18 75.18,55.12
  Top 1.27: C19.2 76.52,55.18 76.96,55.63 76.96,84.58 78.23,85.85 103.12,85.85 104.39,84.58 104.39,78.49 103.38,78.49 102.36,78.49 Q1.D
  Bottom 0.508: v95.76,6.1 101.35,6.1 103.38,8.13 | v73.91,27.69 v85.85,27.69
  Bottom 1.422: 104.39,78.49 Q1.D C6.1 | Q2.D C7.1 110.45,53.09 U$6.D | 103.63,27.69 Q3.D C8.1
  pour Bottom: 102.62,78.99 108.97,78.99 108.97,7.37 102.62,7.37
  pour Top: 73.15,55.88 75.95,55.88 75.95,53.85 74.17,52.07 73.15,52.07
  pour Top: 71.37,40.13 71.37,36.07 73.15,36.07 73.15,38.61 73.91,39.37 73.91,39.88 73.66,40.13
SWCLK
  Top 0.254: U$3.49 20.51,45.41 21.34,46.23 SV3.2
SWDIO
  Top 0.254: SV3.4 29.46,41.15 29.97,40.64 29.97,29.46 29.46,28.96 27.43,28.96 26.71,29.67 U$3.46
USB_D+  (via drill 0.6)
  Top 0.254: U$3.45 25.62,29.17 v26.42,28.7 | R24.2 26.67,6.6 27.18,7.11 v27.18,10.92 | v27.18,15.49 v27.18,21.84
  Bottom 0.254: v26.42,28.7 26.16,28.19 26.16,22.35 v27.18,21.84 | v27.18,10.92 v27.18,15.49
USB_D-  (via drill 0.6)
  Top 0.254: v25.4,28.19 24.92,28.67 U$3.44 22.64,28.7 | R25.2 25.15,8.64 25.65,9.14 v25.65,10.92 | v25.65,15.49 v25.65,21.84
  Bottom 0.254: v25.4,28.19 25.65,27.69 v25.65,21.84 | v25.65,10.92 v25.65,15.49
VCC  (via drill 0.6)
  Top 0.254: U1.24 62.31,41.99 v61.98,41.66 | C35.2 C33.2 | C29.2 C31.2 21.84,21.84 20.57,23.11 20.57,21.08 U$3.32 20.51,28.96 | C32.2 6.16,22.61 7.11,22.61 7.37,22.86 7.37,23.37 8.67,24.67 U$3.13 14.44,24.67 14.86,24.26 | U$3.64 13.01,33.72 12.7,34.04 10.67,34.04 10.41,34.29 | 10.41,34.29 10.41,35.24 C36.2 C34.2 | U1.49 74.12,49.99 75.69,51.56 v75.69,52.07 | U$3.1 10.41,31.12 10.41,34.29 | 22.6,30.73 U$3.48 23.56,30.67 24.13,31.24 24.13,33.02 24.64,33.53 25.33,33.53 C35.2 | C35.2 28.89,33.46 29.46,34.04 29.46,39.62 v28.96,40.13 | 20.51,28.96 20.51,29.91 22.1,31.5 23.37,31.5 23.37,33.27 24.13,34.04 24.83,34.04 C35.2 | 14.86,24.26 14.01,23.41 U$3.19 14.01,19.86 13.46,19.3 13.46,18.35 C30.2 C28.2 14.73,16.26 15.24,15.75 v15.24,15.24 | 14.86,24.26 19.56,28.96 20.51,28.96 | v15.24,10.92 14.99,10.67 R27.2 | v28.96,42.16 29.46,42.16 29.97,42.67 29.97,47.5 28.7,48.77 SV3.1
  Top 0.508: R19.2 v48.77,53.09 | R18.2 v48.77,50.55 | R17.2 v48.77,48.01 | D5.C v64.77,3.81 | D3.C v64.77,7.62 | D2.C v64.77,11.18 | D1.C v64.77,14.73 | v61.98,41.66 61.98,41.4 60.96,40.39 v60.96,18.29 | R26.2 v15.24,4.57
  Top 0.813: SV1.1 26.16,61.98 14.73,50.8 14.73,46.74 | 14.73,46.74 14.73,39.62 13.97,39.12 11.43,39.12 10.67,38.35 10.67,37.53 C34.2 | v13.46,48.77 12.7,48.01 12.7,47.24 13.21,46.74 14.73,46.74
  Bottom 0.254: v61.98,41.66 61.72,41.4 | v15.24,10.92 v15.24,15.24 | v28.96,42.16 v28.96,40.13
  Bottom 0.508: 62.23,41.91 v61.98,41.66 61.98,61.98 | 48.77,48.51 v48.77,48.01 v48.77,50.55 v48.77,53.09 48.77,61.72 49.02,61.98 | SV1.1 49.02,61.98 | 49.02,61.98 61.98,61.98 | 61.98,61.98 73.15,61.98 75.69,59.44 v75.69,52.07 | v64.77,3.81 v64.77,7.62 v64.77,11.18 v64.77,14.73 63.5,14.73 60.96,17.27 v60.96,18.29 | v15.24,4.57 v15.24,10.92
  Bottom 0.813: SV3.1 v13.46,48.77
  pour Top: 40.89,61.21 40.89,71.37 56.9,71.37 56.9,68.33 55.37,68.33 55.37,62.23 53.34,62.23 53.34,66.04 47.5,66.04 47.5,65.28 44.7,65.28 44.7,61.21

### Text on the board
Top: skatemate-motorcontrol v0.1 | FHNW 2017 - p2 team 2